# Altium schematic sheet [1]-Cover.SchDoc
size A3
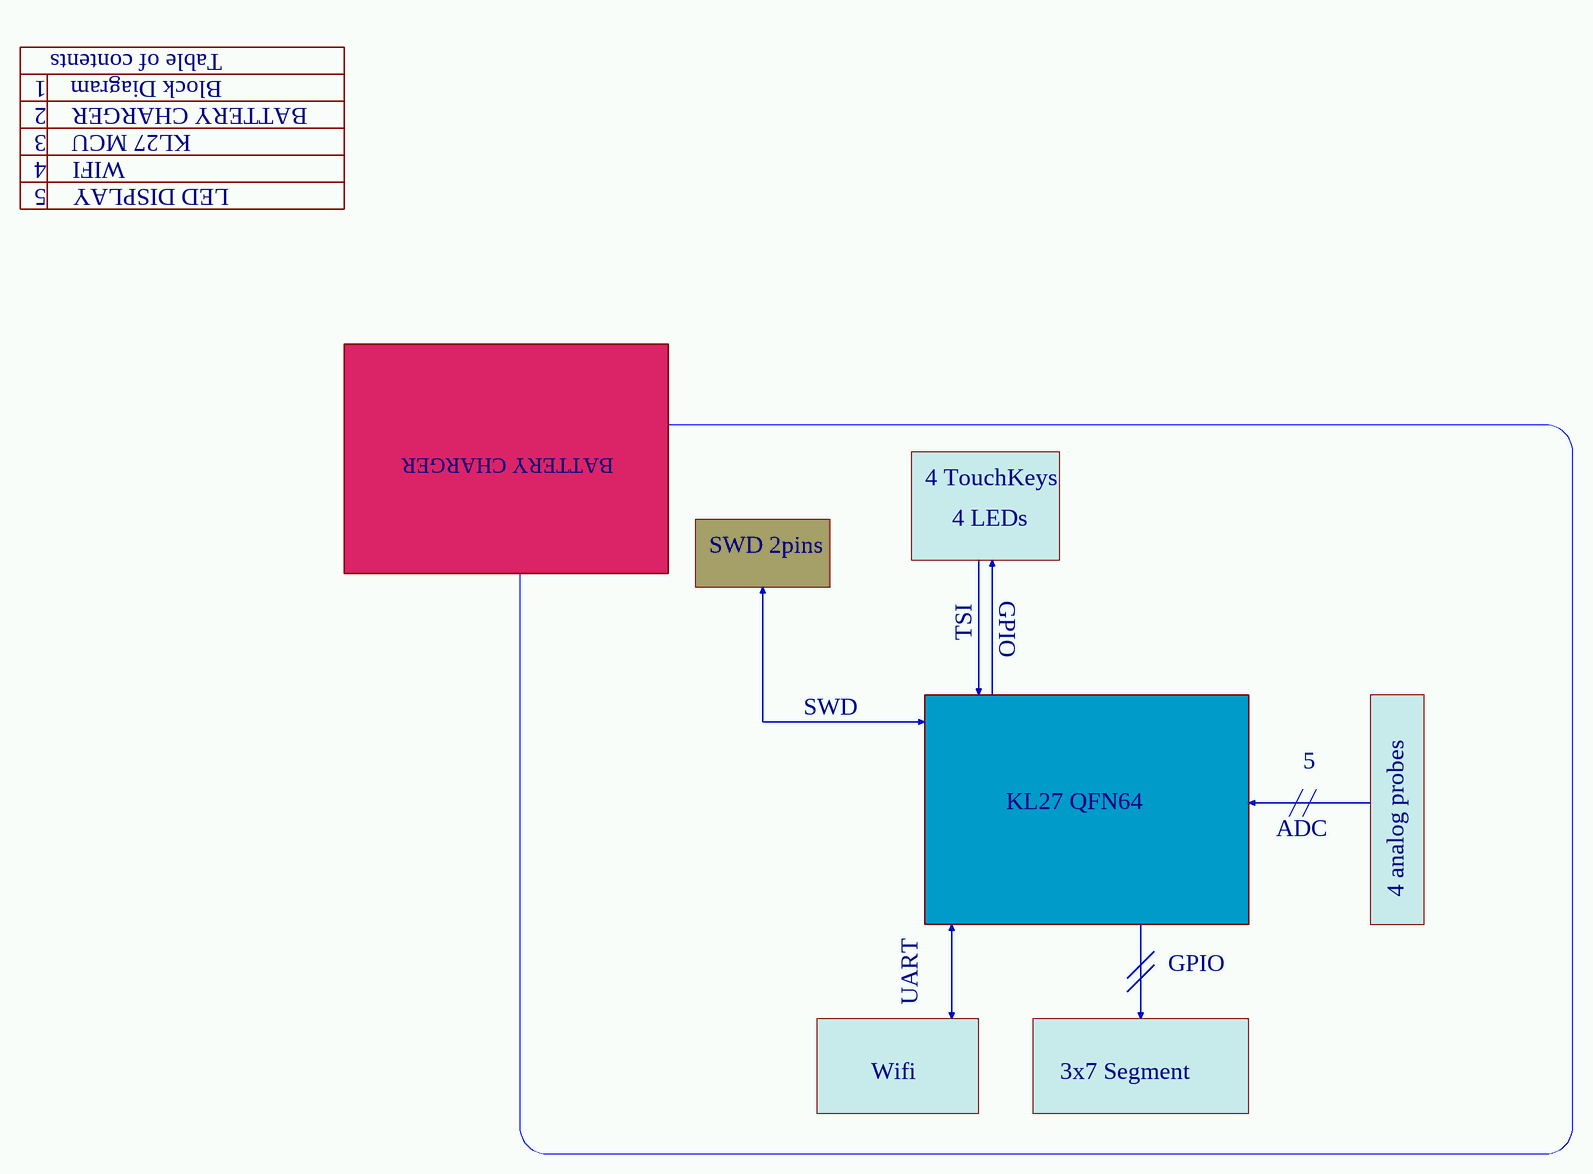
[diagram p0: [1]-Cover.SchDoc]

## Notes on the sheet
- Table of contents
- 1
- 2
- Block Diagram
- BATTERY CHARGER
- 3
- 4
- 5
- WIFI
- KL27 MCU
- LED DISPLAY
- 4 TouchKeys
- SWD 2pins
- 4 LEDs
- TSI
- GPIO
- SWD
- KL27 QFN64
- ADC
- 4 analog probes
- UART
- Wifi
- 3x7 Segment
- Title
- Size:
- Date:
- A3
- Number:
- Time:
- Revision:
- Sheet
- of
- File: